# Altium schematic sheet Power Supply.SchDoc
size A4
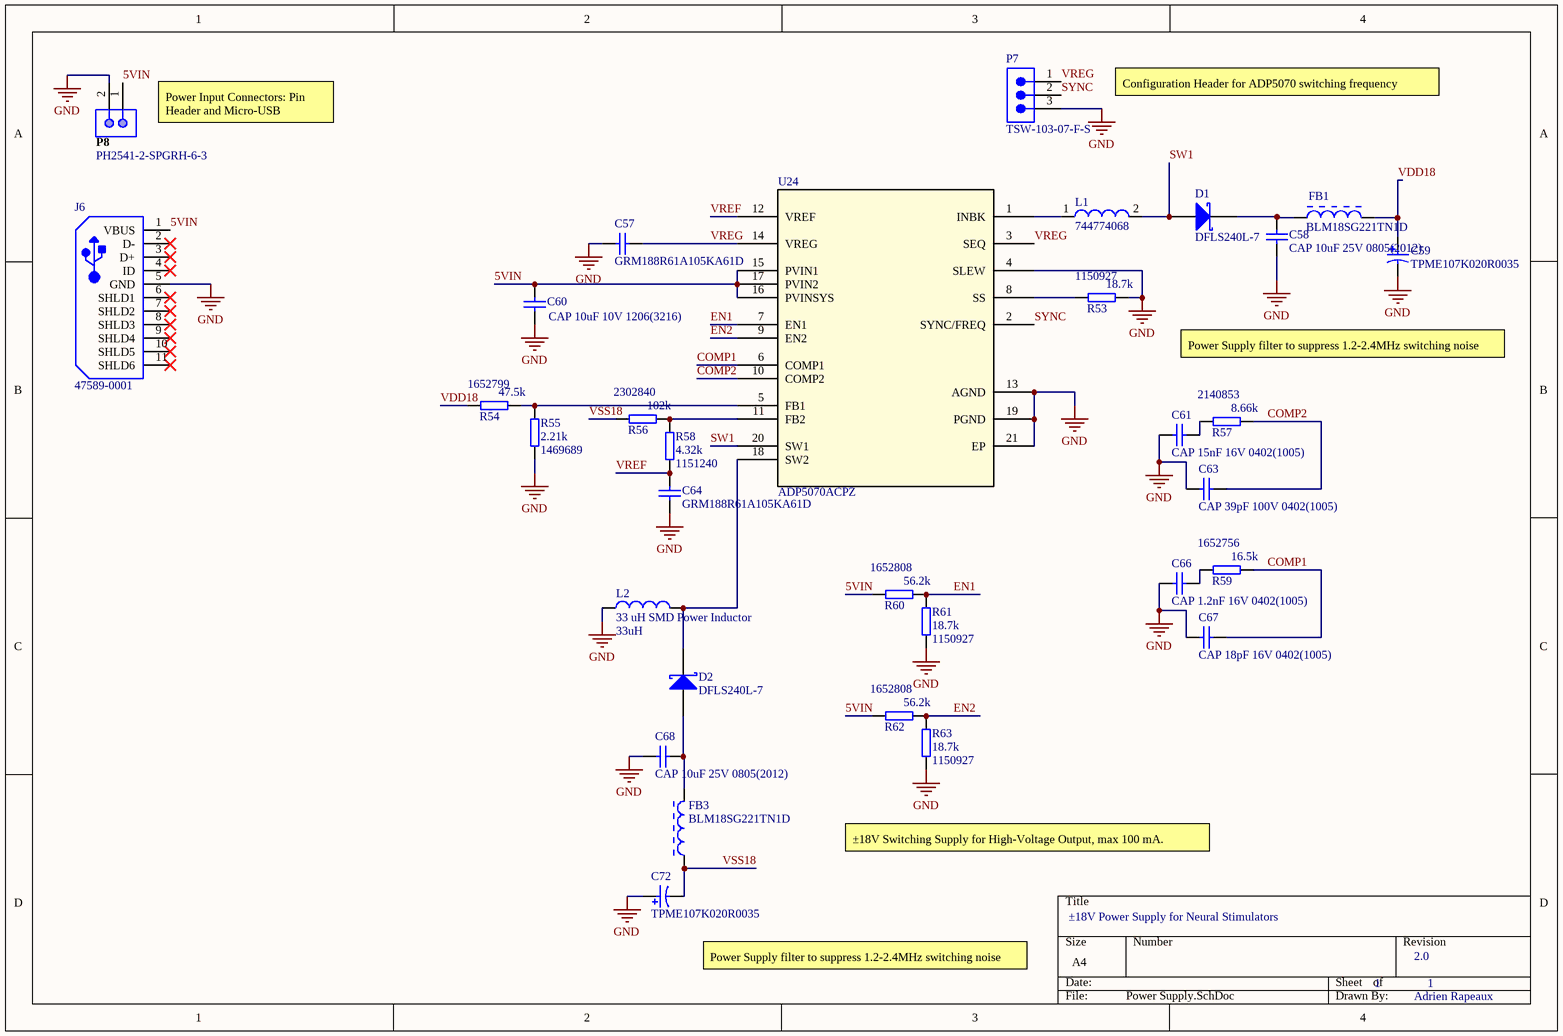
[diagram p0: Power Supply.SchDoc]

## Parts
C57  GRM188R61A105KA61D  [CAPC1608X90X35LL10T15]
C58  CAP 10uF 25V 0805(2012)  [CAPC0805(2012)145_N]
C59  TPME107K020R0035  [CAPMP7344X31-T_V]
C60  CAP 10uF 10V 1206(3216)  [CAPC1206(3216)130_L]
C61  CAP 15nF 16V 0402(1005)  [CAPC0402(1005)60_L]
C63  CAP 39pF 100V 0402(1005)  [CAPC0402(1005)60_L]
C64  GRM188R61A105KA61D  [CAPC1608X90X35LL10T15]
C66  CAP 1.2nF 16V 0402(1005)  [CAPC0402(1005)60_L]
C67  CAP 18pF 16V 0402(1005)  [CAPC0402(1005)60_L]
C68  CAP 10uF 25V 0805(2012)  [CAPC0805(2012)145_N]
C72  TPME107K020R0035  [CAPMP7344X31-T_V]
D1  DFLS240L-7  [DIOD-POWERDI123-2_A_V]
D2  DFLS240L-7  [DIOD-POWERDI123-2_A_V]
FB1  BLM18SG221TN1D  [MURA-BLM18SG-B25-CHIP-2_V1]
FB3  BLM18SG221TN1D  [MURA-BLM18SG-B25-CHIP-2_V1]
J6  47589-0001  [MOLX-47589-0001_V]
L1  744774068  [WE-PD2-M]
L2  33 uH SMD Power Inductor  value 33uH  [LPS6235 SERIES]
P7  TSW-103-07-F-S  [SMTC-TSW-103-07-X-S]
P8  PH2541-2-SPGRH-6-3  [PH2541-2-SPGRH-6-3_V]
R53  18.7k  Supplier Part Number 2: 1150927  [RESC0402]
R54  47.5k  Supplier Part Number 2: 1652799  [RESC0402]
R55  2.21k  Supplier Part Number 1: 1469689  [RESC0402]
R56  102k  Supplier Part Number 1: 2302840  [RESC0402]
R57  8.66k  Supplier Part Number 1: 2140853  [RESC0402]
R58  4.32k  Supplier Part Number 1: 1151240  [RESC0402]
R59  16.5k  Supplier Part Number 1: 1652756  [RESC0402]
R60  56.2k  Supplier Part Number 1: 1652808  [RESC0402]
R61  18.7k  Supplier Part Number 2: 1150927  [RESC0402]
R62  56.2k  Supplier Part Number 1: 1652808  [RESC0402]
R63  18.7k  Supplier Part Number 2: 1150927  [RESC0402]
U24  ADP5070ACPZ  [CP_20_8]

## Nets
GND: C57.1 C58.1 C59.2 C60.1 C61.1 C63.1 C64.1 C66.1 C67.1 C68.1 C72.1 J6.5(GND) L2.1 P7.3 P8.2 R53.1 R55.2 R61.2 R63.2 U24.4(SLEW) U24.13(AGND) U24.19(PGND) U24.21(EP)
5VIN: C60.2 J6.1(VBUS) P8.1 R60.2 R62.2 U24.15(PVIN1) U24.16(PVINSYS) U24.17(PVIN2)
COMP1: C67.2 R59.1 U24.6(COMP1)
COMP2: C63.2 R57.1 U24.10(COMP2)
EN1: R60.1 R61.1 U24.7(EN1)
EN2: R62.1 R63.1 U24.9(EN2)
SW1: D1.1(A) L1.2 U24.20(SW1)
SYNC: P7.2 U24.2(SYNC/FREQ)
VDD18: C59.1 FB1.2 R54.2
VREF: C64.2 R58.2 U24.12(VREF)
VREG: C57.2 P7.1 U24.3(SEQ) U24.14(VREG)
VSS18: C72.2 FB3.1 R56.2
NetC58_2: C58.2 D1.2(K) FB1.1
NetC61_2: C61.2 R57.2
NetC66_2: C66.2 R59.2
NetC68_2: C68.2 D2.1(A) FB3.2
NetD2_2: D2.2(K) L2.2 U24.18(SW2)
NetL1_1: L1.1 U24.1(INBK)
NetR53_2: R53.2 U24.8(SS)
NetR54_1: R54.1 R55.1 U24.5(FB1)
NetR56_1: R56.1 R58.1 U24.11(FB2)

Not connected (* = marked no-connect by the designer): J6 2(D-)* 3(D+)* 4(ID)* 6(SHLD1)* 7(SHLD2)* 8(SHLD3)* 9(SHLD4)* 10(SHLD5)* 11(SHLD6)*

## Notes on the sheet
- Configuration Header for ADP5070 switching frequency
- (near P8) Power Input Connectors: Pin Header and Micro-USB
- Power Supply filter to suppress 1.2-2.4MHz switching noise
- ±18V Switching Supply for High-Voltage Output, max 100 mA.
- ±18V Power Supply for Neural Stimulators
- 1
- 2.0
- Adrien Rapeaux

## Library data of the parts
C57 C64 = CMP-2000-06336-1: Chip Capacitor, 1 uF, +/- 10%, 10 V, -55 to 85 degC, 0603 (1608 Metric), RoHS, Tape and Reel; Manufacturer: Murata; Dielectric: X5R; Voltage Rating: 10V; Case Height: 0.8mm; Temperature Coefficient / Code: +/-15%; Type: GeneralPurposeMLCC; Brand: MurataElectronics; Capacitance: 1uF; Case Length: 1.6mm; Capacitance - nF: 1000nF; Package Description: 2-Pin Surface Mount Device, Body 1.6 x 0.8 mm; Maximum Operating Temperature: +85C; Minimum Operating Temperature: -55C; Mounting Technology: SurfaceMount; RoHS: Details; Package Reference: 0603; Product: GeneralTypeMLCCs; Packaging: Reel; Case Code - mm: 1608; Manufacturer URL: http://www.murata.com/; Dimensions: 0.8mmWx1.6mmLx0.8mmH; Factory Pack Quantity: 4000; Case Code - in: 0603; Tolerance: 10%; Product Category: MultilayerCeramicCapacitorsMLCC-SMD/SMT; Series: GRM; Datasheet Version: 02/2016; Case Width: 0.8mm; Operating Temperature Range: -55Cto+85C; Datasheet URL: http://search.murata.co.jp/Ceramy/image/img/A01X/G101/ENG/GRM188R61A105KA61-01.pdf; Package / Case: 0603(1608metric); Termination Style: SMD/SMT; Voltage Rating DC: 10V
C58 C68 = CMP-1036-04932-1: CAP 10uF 25V ±10% 0805 (2012 Metric) Thickness 1.45mm SMD; Case-EIA: 0805; Case-Metric: 2012; Tolerance: Â±10%; Technology: SMT; Value: 10uF; Rated Voltage: 25 V; Max Thickness: 1.45 mm
C59 C72 = CMP-2000-07300-1: Low ESR, 100 uF, 25 V, +/- 10%, -55 to 125 degC, 2-Pin SMD, RoHS, Tape and Reel; Mfr Case Code: DCase; Manufacturer: AVX; ESR: 100mOhms; Unit Weight: 0.023634oz; Capacitance: 100uF; Voltage Rating: 10V; Tolerance: 20%; Leakage Current: 10uA; Ripple Current: 0.49mA; Qualification: Commercial; Dissipation Factor DF: 6; Product: TantalumSolidLowESRStandardGrade; Case Code - mm: 7343; Length: 7.3mm; Datasheet URL: http://datasheets.avx.com/TPS.pdf; Maximum Operating Temperature: +125C; Manufacturer URL: http://www.avx.com/; Package URL: http://www.avx.com/download/software/literature/AVX-Footprint-Library.pdf; Package / Case: 2917(7343metric); Series: TPS; Package Description: 2-Pin Surface Mount Device, Body 7.3 x 4.35 mm; Minimum Operating Temperature: -55C; Mounting Technology: SurfaceMount; Packaging: Reel; Datasheet Version: 01/2017; RoHS: True; Width: 4.3mm; Brand: AVX; Product Category: TantalumCapacitors-SolidSMD; Height: 3.1mm; Termination Style: SMD/SMT; Package Reference: CAPMP7344X31-T; Case Code - in: 2917; Operating Temperature Range: -55Cto+125C
C60 = CMP-1037-04970-1: CAP 10uF 10V -20% to +80% 1206 (3216 Metric) Thickness 1.3mm SMD; Case-Metric: 3216; Case-EIA: 1206; Value: 10uF; Rated Voltage: 10 V; Technology: SMT; Max Thickness: 1.3 mm; Tolerance: -20% to +80%
C61 = CMP-1034-01913-1: CAP 15nF 16V ±10% 0402 (1005 Metric) Thickness 0.6mm SMD; Case-Metric: 1005; Tolerance: Â±10%; Case-EIA: 0402; Value: 15nF; Rated Voltage: 16 V; Technology: SMT; Max Thickness: 0.6 mm
C63 = CMP-1034-01051-1: CAP 39pF 100V ±10% 0402 (1005 Metric) Thickness 0.6mm SMD; Case-Metric: 1005; Case-EIA: 0402; Tolerance: Â±10%; Technology: SMT; Max Thickness: 0.6 mm; Rated Voltage: 100 V; Value: 39pF
C66 = CMP-1034-01647-1: CAP 1.2nF 16V ±10% 0402 (1005 Metric) Thickness 0.6mm SMD; Case-EIA: 0402; Case-Metric: 1005; Tolerance: Â±10%; Value: 1.2nF; Rated Voltage: 16 V; Max Thickness: 0.6 mm; Technology: SMT
C67 = CMP-1034-00853-1: CAP 18pF 16V ±10% 0402 (1005 Metric) Thickness 0.6mm SMD; Case-Metric: 1005; Tolerance: Â±10%; Case-EIA: 0402; Max Thickness: 0.6 mm; Rated Voltage: 16 V; Value: 18pF; Technology: SMT
D1 D2 = CMP-2000-06158-1: Low VF Schottky Barrier Rectifier, 2 A, 40 V, -55 to 125 degC, 2-Pin SMD, RoHS, Tape and Reel; Manufacturer: Diodes Inc; Reverse Voltage-Max [Vrrm]: 40V; Forward Voltage: 0.5V; Average Rectified Current-Max: 2A; Peak Current-Max: 50A; Reverse Current-Max: 100µA; Mounting Technology: SurfaceMount; Package Description: 2-Pin Small Outline Diode, Body 2.8 x 1.78 mm; Manufacturer URL: http://www.diodes.com/; Datasheet URL: http://www.diodes.com/_files/datasheets/ds30516.pdf; Package Reference: POWERDI123-2_A; Datasheet Version: Rev. 8-2, 11/2009
FB1 FB3 = CMP-0686-00596-2: Chip Ferrite Bead for Power Lines (Low DC Resistance Type), 220 Ohm, 2500 mA, -55 to 125 degC, 1.6 x 0.8 x 0.65 mm SMD, Tape and Reel; Manufacturer: Murata; Impedance (at 100 MHz): 220 Ohm +/- 25%; DC Resistance: 0.040 Ohm Max.; Rated Current: 2500 mA; ComponentLink2Description: Datasheet; ComponentLink1Description: Manufacturer URL; ComponentLink3Description: Package Specification; DatasheetVersion: 08/2013; Packing: Tape and Reel; PackageReference: BLM18_H650-2; PackageDescription: 2-Pin Chip, Body 1.6 x 0.8 mm; Mounting Technology: Surface Mount; Operating Temperature Range: -55 to 125 degC; ComponentLink1URL: http://www.murata.com/; ComponentLink2URL: http://www.murata.com/products/catalog/pdf/c31e.pdf; ComponentLink3URL: http://www.murata.com/products/catalog/pdf/c31e.pdf; PartNumber: BLM18SG221TN1D
J6 = CMP-2000-05610-1: Right Angle Female Type AB Micro USB Connector, 30 V, 1.8 A, -30 to 85 degC, RoHS, Tape and Reel; Number of Ports: 1Port; Current Rating: 1.8A; Brand: Molex; Connector Type: MicroUSBTypeABreceptacle; Number of Contacts: 5Contact; Voltage Rating: 30VAC; Color: Black; Product: MicroUSBTypeABConnectors; Package URL: http://www.molex.com/pdm_docs/sd/475890001_sd.pdf; Contact Plating: Gold; Datasheet URL: http://www.molex.com/webdocs/datasheets/pdf/en-us/0475890001_IO_CONNECTORS.pdf; Operating Temperature Range: -20Cto+85C; Termination Style: SMD/SMT; Mounting Angle: Right; Package Reference: 47589-0001; Gender: Female; Package Description: Micro USB Connector, Pitch 0.65 mm, 5 Positions, Body 7.5 x 5.6 mm; Mounting Technology: SurfaceMount; Contact Material: CopperAlloy; Packaging: Reel; RoHS: True; Standard: USB; Manufacturer URL: http://www.molex.com/; Manufacturer: Molex; Datasheet Version: 12/2016; Product Category: USBConnectors; Series: 47589
L1 = CMP-0227-00446-1: SMD Power Inductor WE-PD2, L = 6.80 µH; Inductance: 6.80 ÂµH; ComponentLink1Description: Manufacturer Link; PackageVersion: 2005; ComponentLink1URL: http://www.we-online.com; ComponentLink2URL: http://www.we-online.de/katalog/media/pdf/744774068.pdf; PackageReference: WE-PD2-M; PackageDescription: SMD Inductor, 2-Leads, Body 5.8 x 5.2 mm; DatasheetVersion: ver 3, Jun-2006; ComponentLink2Description: Datasheet
L2 = LPS6235-333MRB: 33 uH SMD Power Inductor, 1A RMS, 1.4A Isat, Shielded, LPS6235 Series, Coilcraft; Published: 8-Jun-2000; LatestRevisionDate: 23 Nov 2018; LatestRevisionNote: N/A; PackageReference: LPS6235 SERIES; Publisher: Adrien Rapeaux; PackageDescription: 6mm x 6mm x 3.5mm; Code_JEITA: N/A; Code_IEC: N/A
P7 = CMP-1024-00331-1: 0.025" SQ Post Header, Through-hole, Vertical, -55 to 125 degC, 2.54 mm Pitch, 3-Pin, Male, RoHS; Manufacturer: Samtec; Pitch: 2.54 mm; DatasheetVersion: F-214; ComponentLink1Description: Manufacturer URL; ComponentLink3URL: http://www.samtec.com/documents/webfiles/cpdf/TSW-XXX-XX-XXX-X-XX-XXX-MKT.pdf; Mounting Technology: Through-hole; PackageDescription: .025[0.64] SQ. Post Terminal Strip Assembly; Temperature Range: -55 to 125 degC; ComponentLink3Description: Package Specification; Orientation: Vertical; PartNumber: TSW-103-07-F-S; RoHS: True; PackageVersion: DM, 8/1988; ComponentLink2Description: Datasheet; ComponentLink1URL: http://www.samtec.com; ComponentLink2URL: http://www.samtec.com/documents/webfiles/pdf/TSW_TH.PDF; PackageReference: TSW-103-07-X-S
P8 = CMP-0261-00001-1: Male Header, Pitch 2.54mm, 2x1 Position, Mated Height 6mm, Tail Length 3mm; PackageDescription: 2-Pin Male Header IDC, 2.54 x 5.08 mm Body, 2.54 mm Pitch; PartNumber: PH2541-2-SPGRH-6-3; ComponentLink1URL: http://www.suzhoupinchao.com/; Mounting Technology: Through Hole; ComponentLink1Description: Manufacturer URL; PackageReference: PH2541-2-SPGRH-6-3
R53 R61 R63 = myProto-12585: RES 18K7 0402 0.063W 1%; Part Number dvc: 12585; Manufacturer Part Number: CRCW040218K7FKTDBC; manufacturer: VISHAY; Prefered: Oui; device: Resistor; Part Number MyProto: myProto-12585; Category: Resistor; ComponentLink1Description: Manufacturer Link; ComponentLink1URL: http://www.vishay.com/; ComponentLink2Description: Datasheet; ComponentLink2URL: https://www.vishay.com/docs/20035/dcrcwe3.pdf; Pin Count: 2; Value: 18K7; casePackage: 0402; PowerRating: 0.063 W; Tolerance: 1%; Supplier 1: Farnell; Supplier 2: Farnell
R54 = myProto-12633: RES 47K5 0402 0.063W 1%; Part Number dvc: 12633; Manufacturer Part Number: CRCW040247K5FKTDBC; manufacturer: VISHAY; Prefered: Oui; device: Resistor; Part Number MyProto: myProto-12633; Category: Resistor; ComponentLink1Description: Manufacturer Link; ComponentLink1URL: http://www.vishay.com/; ComponentLink2Description: Datasheet; ComponentLink2URL: https://www.vishay.com/docs/20035/dcrcwe3.pdf; Pin Count: 2; Value: 47K5; casePackage: 0402; PowerRating: 0.063 W; Tolerance: 1%; Supplier 1: Farnell; Supplier 2: Farnell
R55 = myProto-12479: RES 2K21 0402 0.063W 1%; Part Number dvc: 12479; Manufacturer Part Number: CRCW04022K21FKTDBC; manufacturer: VISHAY; Prefered: Oui; device: Resistor; Part Number MyProto: myProto-12479; Category: Resistor; ComponentLink1Description: Manufacturer Link; ComponentLink1URL: http://www.vishay.com/; ComponentLink2Description: Datasheet; ComponentLink2URL: https://www.vishay.com/docs/20035/dcrcwe3.pdf; Pin Count: 2; Value: 2K21; casePackage: 0402; PowerRating: 0.063 W; Tolerance: 1%; Supplier 1: Farnell
R56 = myProto-12671: RES 102K 0402 0.063W 1%; Part Number dvc: 12671; Manufacturer Part Number: CRCW0402102KFKTDBC; manufacturer: VISHAY; Prefered: Oui; device: Resistor; Part Number MyProto: myProto-12671; Category: Resistor; ComponentLink1Description: Manufacturer Link; ComponentLink1URL: http://www.vishay.com/; ComponentLink2Description: Datasheet; ComponentLink2URL: https://www.vishay.com/docs/20035/dcrcwe3.pdf; Pin Count: 2; Value: 102K; casePackage: 0402; PowerRating: 0.063 W; Tolerance: 1%; Supplier 1: Farnell
R57 = myProto-12549: RES 8K66 0402 0.063W 1%; Part Number dvc: 12549; Manufacturer Part Number: CRCW04028K66FKTDBC; manufacturer: VISHAY; Prefered: Oui; device: Resistor; Part Number MyProto: myProto-12549; Category: Resistor; ComponentLink1Description: Manufacturer Link; ComponentLink1URL: http://www.vishay.com/; ComponentLink2Description: Datasheet; ComponentLink2URL: https://www.vishay.com/docs/20035/dcrcwe3.pdf; Pin Count: 2; Value: 8K66; casePackage: 0402; PowerRating: 0.063 W; Tolerance: 1%; Supplier 1: Farnell
R58 = myProto-12514: RES 4K32 0402 0.063W 1%; Part Number dvc: 12514; Manufacturer Part Number: CRCW04024K32FKTDBC; manufacturer: VISHAY; Prefered: Oui; device: Resistor; Part Number MyProto: myProto-12514; Category: Resistor; ComponentLink1Description: Manufacturer Link; ComponentLink1URL: http://www.vishay.com/; ComponentLink2Description: Datasheet; ComponentLink2URL: https://www.vishay.com/docs/20035/dcrcwe3.pdf; Pin Count: 2; Value: 4K32; casePackage: 0402; PowerRating: 0.063 W; Tolerance: 1%; Supplier 1: Farnell
R59 = myProto-12579: RES 16K5 0402 0.063W 1%; Part Number dvc: 12579; Manufacturer Part Number: CRCW040216K5FKTDBC; manufacturer: VISHAY; Prefered: Oui; device: Resistor; Part Number MyProto: myProto-12579; Category: Resistor; ComponentLink1Description: Manufacturer Link; ComponentLink1URL: http://www.vishay.com/; ComponentLink2Description: Datasheet; ComponentLink2URL: https://www.vishay.com/docs/20035/dcrcwe3.pdf; Pin Count: 2; Value: 16K5; casePackage: 0402; PowerRating: 0.063 W; Tolerance: 1%; Supplier 1: Farnell
R60 R62 = myProto-12642: RES 56K2 0402 0.063W 1%; Part Number dvc: 12642; Manufacturer Part Number: CRCW040256K2FKTDBC; manufacturer: VISHAY; Prefered: Oui; device: Resistor; Part Number MyProto: myProto-12642; Category: Resistor; ComponentLink1Description: Manufacturer Link; ComponentLink1URL: http://www.vishay.com/; ComponentLink2Description: Datasheet; ComponentLink2URL: https://www.vishay.com/docs/20035/dcrcwe3.pdf; Pin Count: 2; Value: 56K2; casePackage: 0402; PowerRating: 0.063 W; Tolerance: 1%; Supplier 1: Farnell
U24 = ADP5070ACPZ: Imported; RefDes: RefDes; Type: DEV; Value: Value